# Altium schematic sheet SCH_onelayer.SchDoc
size A3; SheetNumber: 1; SheetTotal: 1
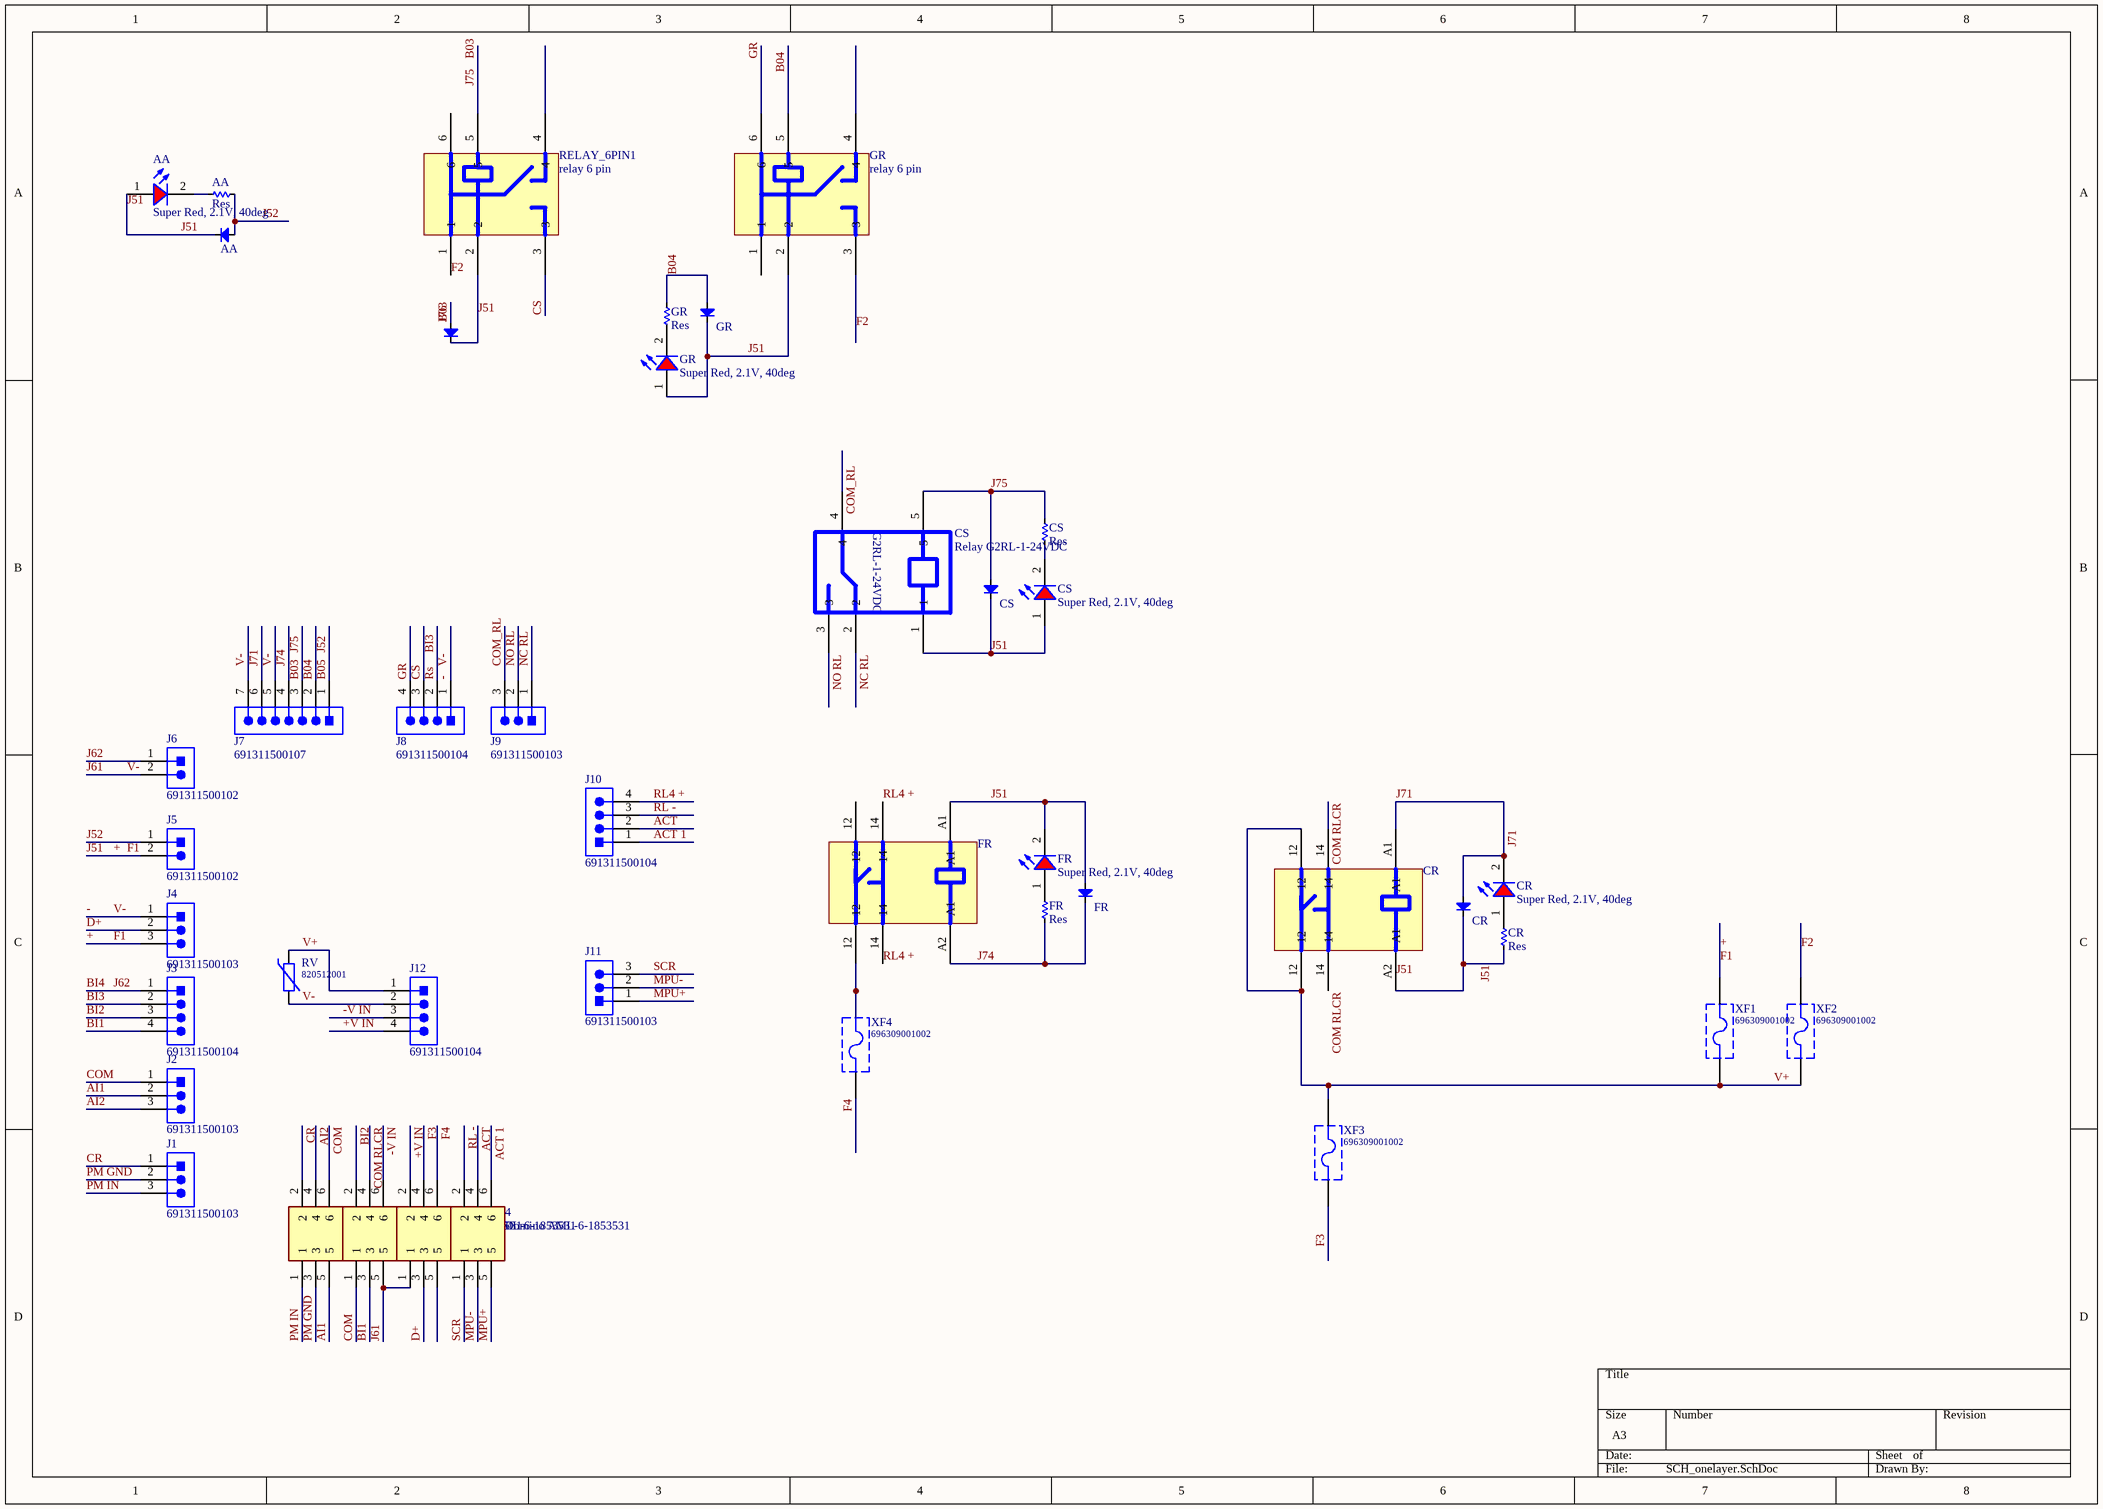
[diagram p0: SCH_onelayer.SchDoc]

## Parts
(Parts that share a designator on the sheet are numbered #1, #2 ... from top to bottom, then left to right.)
1  Domino AML-6-1853531  [AML-6-1853531]
2  Domino AML-6-1853531  [AML-6-1853531]
3  Domino AML-6-1853531  [AML-6-1853531]
4  Domino AML-6-1853531  [AML-6-1853531]
?  Diode  [DIO-1A]  (value not drawn)
AA#1  Super Red, 2.1V, 40deg  [WL-TMRC_5mm]
AA#2  Res  [RES-1/2W]
AA#3  Diode  [DIO-1A]  (value not drawn)
CR#1  (no value)  [Relay 6 pin SMIH-SL-A]
CR#2  Diode  [DIO-1A]  (value not drawn)
CR#3  Super Red, 2.1V, 40deg  [WL-TMRC_5mm]
CR#4  Res  [RES-1/2W]
CS#1  Res  [RES-1/2W]
CS#2  Relay G2RL-1-24VDC  [G2RL-1-24VDC]
CS#3  Diode  [DIO-1A]  (value not drawn)
CS#4  Super Red, 2.1V, 40deg  [WL-TMRC_5mm]
FR#1  (no value)  [Relay 6 pin SMIH-SL-A]
FR#2  Super Red, 2.1V, 40deg  [WL-TMRC_5mm]
FR#3  Diode  [DIO-1A]  (value not drawn)
FR#4  Res  [RES-1/2W]
GR#1  relay 6 pin  [relay 6 pin]
GR#2  Res  [RES-1/2W]
GR#3  Diode  [DIO-1A]  (value not drawn)
GR#4  Super Red, 2.1V, 40deg  [WL-TMRC_5mm]
J1  691311500103  [691311500103]
J2  691311500103  [691311500103]
J3  691311500104  [691311500104]
J4  691311500103  [691311500103]
J5  691311500102  [691311500102]
J6  691311500102  [691311500102]
J7  691311500107  [691311500107]
J8  691311500104  [691311500104]
J9  691311500103  [691311500103]
J10  691311500104  [691311500104]
J11  691311500103  [691311500103]
J12  691311500104  [691311500104]
RELAY_6PIN1  relay 6 pin  [relay 6 pin]
RV  820512001  [D12.5xW5.1xH15.5xP0.8]
XF1  696309001002  [696309001002]
XF2  696309001002  [696309001002]
XF3  696309001002  [696309001002]
XF4  696309001002  [696309001002]

## Nets
+: ?.2(K) AA#1.1(A) AA#3.2(K) CR#1.A2(A1) CR#2.2(K) CR#4.1 CS#2.1 CS#3.2(K) CS#4.1(A) FR#1.A1 FR#2.2(K) FR#3.1(A) GR#1.2 GR#3.2(K) GR#4.1(A) J4.3 J5.2 RELAY_6PIN1.2 XF1.2  [also labelled F1, J51]
+V IN: 3.2 J12.4
-: 2.5 3.1 J4.1 J6.2 J7.5 J7.7 J8.1 J12.2 RV.2  [also labelled J61, V-]
-V IN: 2.6 J12.3
ACT: 4.4 J10.2
ACT 1: 4.6 J10.1
AI1: 1.5 J2.2
AI2: 1.4 J2.3
B03: ?.1(A) CS#1.1 CS#2.5 CS#3.1(A) J7.3 RELAY_6PIN1.5  [also labelled J75, J76]
B04: GR#1.5 GR#2.2 GR#3.1(A) J7.2
B05: AA#2.1 AA#3.1(A) J5.1 J7.1  [also labelled J52]
BI1: 2.3 J3.4
BI2: 2.2 J3.3
BI3: J3.2 J8.2  [also labelled Rs]
BI4: J3.1 J6.1  [also labelled J62]
COM: 1.6 2.1 J2.1
COM RLCR: 2.4 CR#1.14
COM_RL: CS#2.4 J9.3
CR: 1.2 J1.1
CS: J8.3 RELAY_6PIN1.3
D+: 3.3 J4.2
F2: GR#1.3 RELAY_6PIN1.1 XF2.2
F3: 3.4 XF3.1
F4: 3.6 XF4.1
GR: GR#1.6 J8.4
J71: CR#1.A1 CR#2.1(A) CR#3.2(K) J7.6
J74: FR#1.A2(A1) FR#3.2(K) FR#4.2 J7.4
MPU+: 4.5 J11.1
MPU-: 4.3 J11.2
NC RL: CS#2.2 J9.1
NO RL: CS#2.3 J9.2
PM GND: 1.3 J1.2
PM IN: 1.1 J1.3
RL4 +: FR#1.14 J10.4
RL -: 4.2 J10.3
SCR: 4.1 J11.3
V+: CR#1.12 J12.1 RV.1 XF1.1 XF2.1 XF3.2
NetAA#1_2: AA#1.2(K) AA#2.2
NetCR#3_1: CR#3.1(A) CR#4.2
NetCS#1_2: CS#1.2 CS#4.2(K)
NetFR#1_12: FR#1.12 XF4.2
NetFR#2_1: FR#2.1(A) FR#4.1
NetGR#2_1: GR#2.1 GR#4.2(K)

Not connected (* = marked no-connect by the designer): 3 5; GR#1 1 4; RELAY_6PIN1 4 6

## Notes on the sheet
- Labels drawn without touching a wire or pin: J51
- (in symbol Relay G2RL-1-24VDC) G2RL-1-24VDC

## Library data of the parts
? AA#3 CR#2 CS#3 FR#3 GR#3 = Diode: Default Diode; Code - JEDEC: DO-214-AB; Value: 1N5007; Published: 8-Jun-2000; Revision: July-2002: Re-released for DXP Platform.; Publisher: Altium Limited
AA#1 CR#3 CS#4 FR#2 GR#4 = 151051SS04000: WL-TMRC THT Mono-color Round Color, size 5mm, Super Red, 2.1V, 40deg; Luminous Intensity: 250mcd; Dominant Wavelength: 635nm; Peak Wavelength: 640nm; Chip Technology: AlInGaP; ComponentLink1Description: Manufacturer; ComponentLink1URL: http://www.we-online.de; ComponentLink2Description: Datasheet; ComponentLink2URL: https://katalog.we-online.de/led/datasheet/151051SS04000.pdf; Emitting Color: Super Red; Operating Temperature: -40 to +85degC; Mounting Technology: THT; Forward Voltage: 2.1V; Part Number: 151051SS04000; Packaging: Bulk; Published Date: January 2021; Publisher: Wurth Elektronik; Size: 5mm; Viewing Angle: 40deg
AA#2 CR#4 CS#1 FR#4 GR#2 = Res: Manufacturer: Generic Components; Class: Passive; SubClass: R; Published: 08/06/2000; Publisher: Altium Hobart Technology Centre
CR#1 FR#1 = Relay DMIH-05/12/24VDC-SL-A songle 16A 6pin
J1 J2 J4 J9 J11 = 691311500103: WR-TBL Serie 311 Close Vertical PCB Header, Pluggable, THT, pitch 5.08mm, 3p; Manufacturer: Wurth Elektronik; Modularity: No; Pin Number: 3; Rated Current [UL]: 20A; Working Voltage [UL]: 300VAC; ComponentLink1Description: Manufacturer; ComponentLink1URL: http://www.we-online.de; ComponentLink2URL: https://katalog.we-online.de/em/datasheet/691311500103.pdf; ComponentLink2Description: Datasheet; Mounting Technology: THT; Manufacturer Part Number: 691311500103; Packaging: Box; Operating Temperature: -40 to +105degC; PCB/Cable/Panel: PCB; Pitch: 5.08mm; Published Date: Feburary 2021; Type: Vertical; Application: Pluggable
J3 J8 J10 J12 = 691311500104: WR-TBL Serie 311 Close Vertical PCB Header, Pluggable, THT, pitch 5.08mm, 4p; Manufacturer: Wurth Elektronik; Modularity: No; Pin Number: 4; Rated Current [UL]: 20A; Working Voltage [UL]: 300VAC; ComponentLink1Description: Manufacturer; ComponentLink1URL: http://www.we-online.de; ComponentLink2URL: https://katalog.we-online.de/em/datasheet/691311500104.pdf; ComponentLink2Description: Datasheet; Mounting Technology: THT; Manufacturer Part Number: 691311500104; Packaging: Box; Operating Temperature: -40 to +105degC; PCB/Cable/Panel: PCB; Pitch: 5.08mm; Published Date: Feburary 2021; Type: Vertical; Application: Pluggable
J5 J6 = 691311500102: WR-TBL Serie 311 Close Vertical PCB Header, Pluggable, THT, pitch 5.08mm, 2p; Manufacturer: Wurth Elektronik; Modularity: No; Pin Number: 2; Rated Current [UL]: 20A; Working Voltage [UL]: 300VAC; ComponentLink1Description: Manufacturer; ComponentLink1URL: http://www.we-online.de; ComponentLink2URL: https://katalog.we-online.de/em/datasheet/691311500102.pdf; ComponentLink2Description: Datasheet; Mounting Technology: THT; Manufacturer Part Number: 691311500102; Packaging: Box; Operating Temperature: -40 to +105degC; PCB/Cable/Panel: PCB; Pitch: 5.08mm; Published Date: Feburary 2021; Type: Vertical; Application: Pluggable
J7 = 691311500107: WR-TBL Serie 311 Close Vertical PCB Header, Pluggable, THT, pitch 5.08mm, 7p; Manufacturer: Wurth Elektronik; Modularity: No; Pin Number: 7; Rated Current [UL]: 20A; Working Voltage [UL]: 300VAC; ComponentLink1Description: Manufacturer; ComponentLink1URL: http://www.we-online.de; ComponentLink2URL: https://katalog.we-online.de/em/datasheet/691311500107.pdf; ComponentLink2Description: Datasheet; Mounting Technology: THT; Manufacturer Part Number: 691311500107; Packaging: Box; Operating Temperature: -40 to +105degC; PCB/Cable/Panel: PCB; Pitch: 5.08mm; Published Date: Feburary 2021; Type: Vertical; Application: Pluggable
RV = 820512001: WE-VD Disk Varistor, D12.5mm, W5.1mm, H15.5mm, 20VAC, 26VDC; Manufacturer: Wurth Elektronik; (Channel) Input Capacitance: 4250pF; (Reverse) Peak Pulse Current: 500A; (Reverse) Breakdown Voltage: 33V; Clamping Voltage: 65V; AC Operating Voltage: 20V; DC Operating Voltage: 26V; Energy Absorbtion: 4.4J; Power Dissipation: 0.05W; ComponentLink1URL: http://www.we-online.de; ComponentLink2Description: Datasheet; ComponentLink2URL: https://www.we-online.com/catalog/datasheet/820512001.pdf; ComponentLink1Description: Manufacturer; Diameter: 12.5mm; Mounting Technology: THT; Height max.: 15.5mm; Operating Temperature: -40 to +85degC; Packaging: Tape and Reel; Manufacturer Part Number: 820512001; Width max.: 5.1mm; Published Date: April 2020; Width typ.: 3.3mm
XF1-XF4 = 696309001002: WR-FSH Shocksafe Fuse Holder Turn and Lock Cover for PCB; Manufacturer: Wurth Elektronik; Fuse Size: 5x20mm; ComponentLink1Description: Manufacturer; ComponentLink1URL: http://www.we-online.de; ComponentLink2Description: Datasheet; ComponentLink2URL: https://www.we-online.com/catalog/datasheet/696309001002.pdf; Manufacturer Part Number: 696309001002; Published Date: March 2021; Operating Temperature: -30 to +120degC; Mounting Technology: THT; Packaging: Box